# EAGLE design MAX3221EEAE-Breakout (EAGLE 7.6.0)
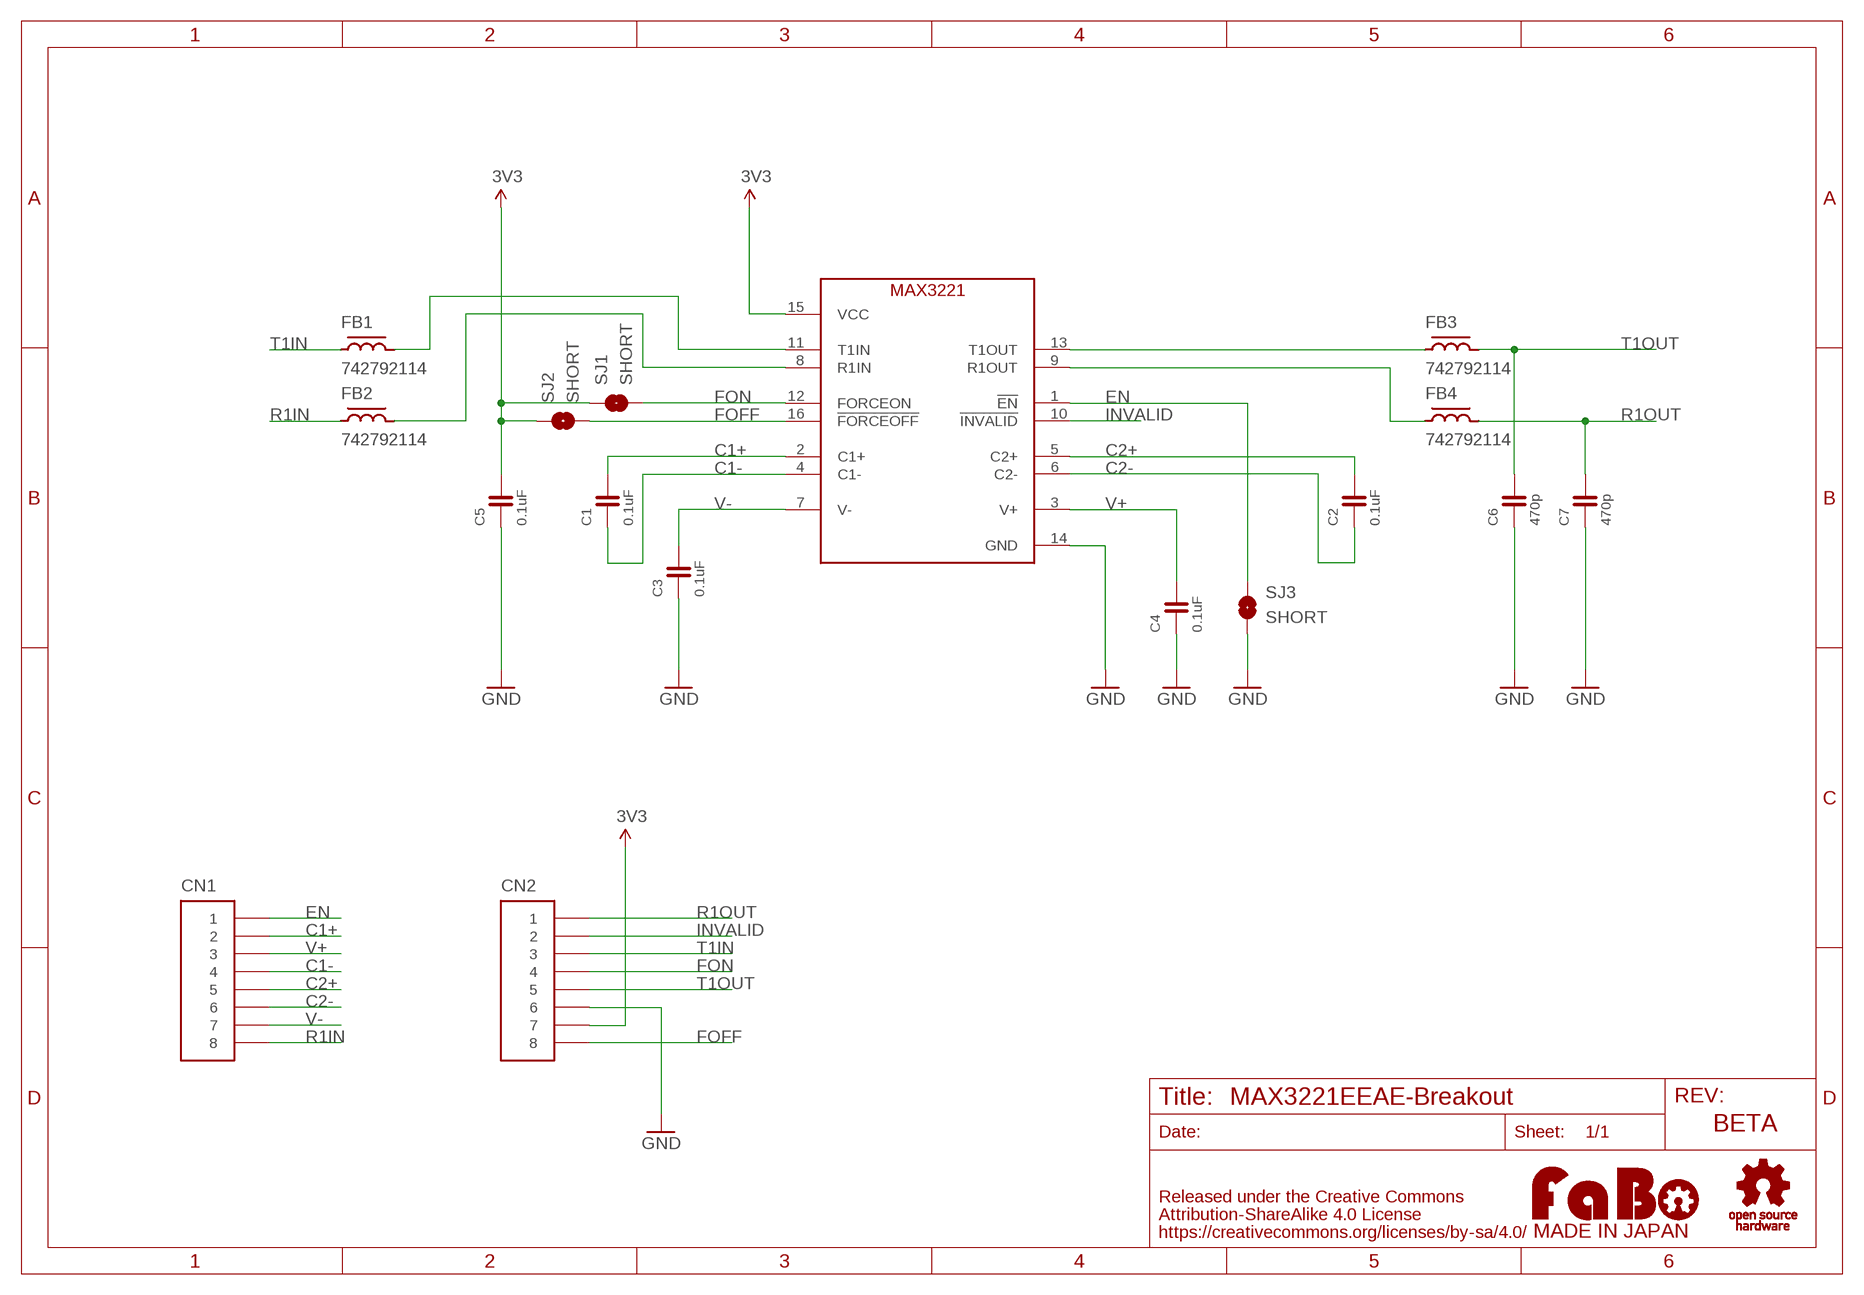
[diagram p0: schematic, sheet 1]

## Parts
C1  0.1uF  CAPACITOR-0603  [0603]
C2  0.1uF  CAPACITOR-0603  [0603]
C3  0.1uF  CAPACITOR-0603  [0603]
C4  0.1uF  CAPACITOR-0603  [0603]
C5  0.1uF  CAPACITOR-0603  [0603]
C6  470p  CAPACITOR-0603  [0603]
C7  470p  CAPACITOR-0603  [0603]
CN1  PIN_HEADER_1X8  [PIN_1X8]
CN2  PIN_HEADER_1X8  [PIN_1X8]
FB1  742792114  FERRITEBEADS-1206  [EIA1206]
FB2  742792114  FERRITEBEADS-1206  [EIA1206]
FB3  742792114  FERRITEBEADS-1206  [EIA1206]
FB4  742792114  FERRITEBEADS-1206  [EIA1206]
IC1  MAX3221EEAE  [SSOP-16]
SJ1  SHORT  SMD-JUMPER-2-SHORT  [SMD-JUMPER-2-SHORT]
SJ2  SHORT  SMD-JUMPER-2-SHORT  [SMD-JUMPER-2-SHORT]
SJ3  SHORT  SMD-JUMPER-2-SHORT  [SMD-JUMPER-2-SHORT]
U$2  LOGO_FABO-M_BOTTOM  [LOGO_FABO_MS_BOTTOM]
U$3  LOGO_OSHW-M_BOTTOM  [LOGO_OSHW_M_BOTTOM]

## Nets
3V3: C5.2 CN2.7 IC1.15(VCC) SJ1.1 SJ2.1
C1+: C1.2 CN1.2 IC1.2(C1+)
C1-: C1.1 CN1.4 IC1.4(C1-)
C2+: C2.2 CN1.5 IC1.5(C2+)
C2-: C2.1 CN1.6 IC1.6(C2-)
EN: CN1.1 IC1.1(!EN) SJ3.1
FOFF: CN2.8 IC1.16(!FORCEOFF) SJ2.2
FON: CN2.4 IC1.12(FORCEON) SJ1.2
GND: C3.1 C4.1 C5.1 C6.1 C7.1 CN2.6 IC1.14(GND) SJ3.2
INVALID: CN2.2 IC1.10(!INVALID)
R1IN: CN1.8 FB2.1
R1IN_R: FB2.2 IC1.8(R1IN)
R1OUT: C7.2 CN2.1 FB4.2
R1OUT_R: FB4.1 IC1.9(R1OUT)
T1IN: CN2.3 FB1.1
T1IN_R: FB1.2 IC1.11(T1IN)
T1OUT: C6.2 CN2.5 FB3.2
T1OUT_R: FB3.1 IC1.13(T1OUT)
V+: C4.2 CN1.3 IC1.3(V+)
V-: C3.2 CN1.7 IC1.7(V-)

## Notes on the sheet
- BETA

## Library data of the parts
C1-C7 = FaBo-Capacitor:CAPACITOR: CAPACITOR
CN1 CN2 = FaBo-PIN:PIN_HEADER_1X8
FB1-FB4 = FaBo-Parts:FERRITEBEADS
IC1 = FaBo-LevelTranslator:MAX3221EEAE
SJ1-SJ3 = FaBo-Supply:SMD-JUMPER-2
U$2 = FaBo-etc:LOGO_FABO
U$3 = FaBo-etc:LOGO_OSHW

## Board
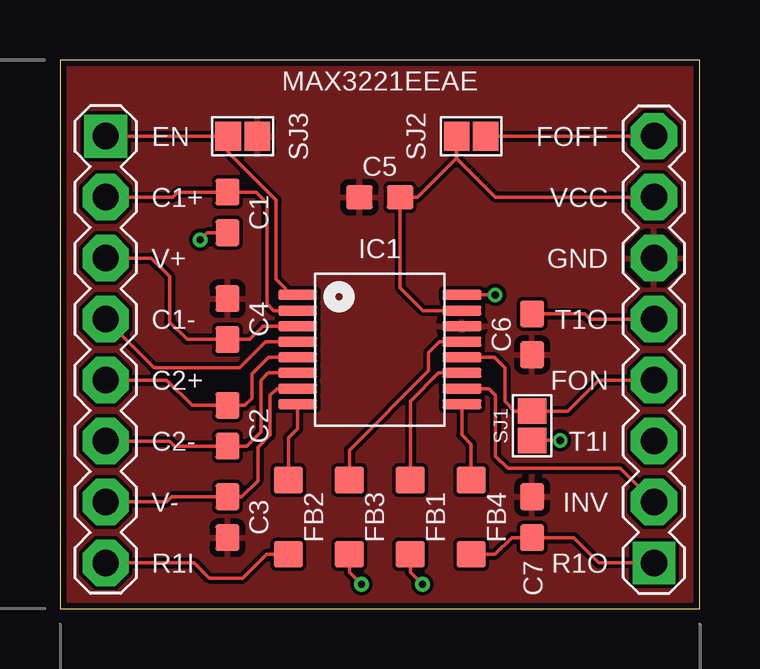
[diagram p1: board, top side]
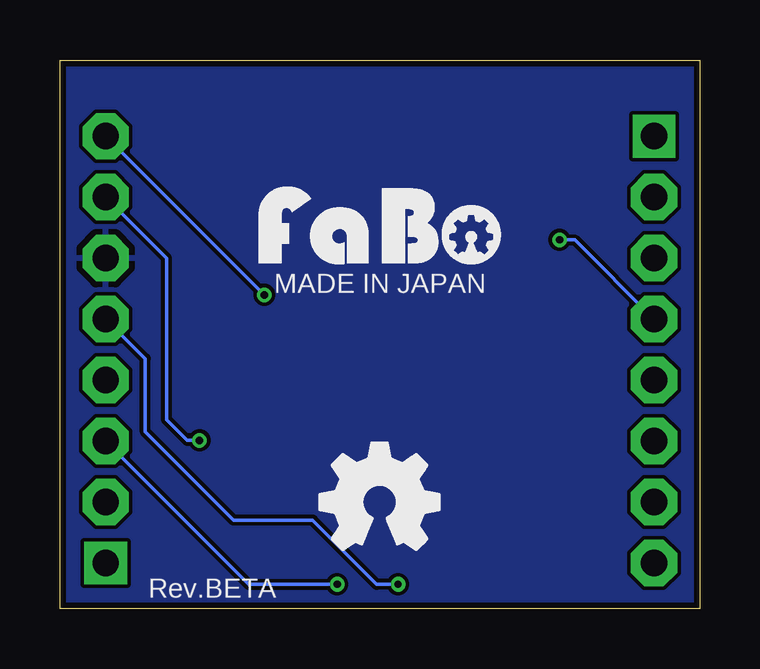
[diagram p2: board, bottom side, seen from below]

Size 26.67 x 22.86 mm. Coordinates in mm from the lower left corner, seen from the top.
Outline: 0,0 26.67,0 26.67,22.86 0,22.86 0,0
Copper layers (1*16): Top 0.035mm / dielectric 1.5mm / Bottom 0.035mm
Design rules "Elecrow_angle": minimum track width 6mil, minimum drill 12mil, track to track 6mil, track to pad 6mil, pad to pad 6mil, via to via 6mil, smd to smd 0mil, copper to edge 10mil, drill to drill 10mil, minimum pad ring 10mil, minimum via ring 6mil, stop-mask expansion 2mil, vias tented up to drill 100mil, thermal gap 10mil

### Footprints (pad centres in the part's own frame; a part is rotated, then mirrored left to right if it is on the bottom)
0603 = smd 1.1 x 1: 1 -0.85,0; 2 0.85,0
PIN_1X8 = drill 1.1 pad 1.778 square: 1 -8.89,0 | drill 1.1 pad 1.93 octagon: 2 -6.35,0; 3 -3.81,0; 4 -1.27,0; 5 1.27,0; 6 3.81,0; 7 6.35,0; 8 8.89,0
EIA1206 = smd 1.1 x 1.2: 1 -1.55,0; 2 1.55,0
SSOP-16 = smd 1.63 x 0.42: 1 -3.425,2.275; 2 -3.425,1.625; 3 -3.425,0.975; 4 -3.425,0.325; 5 -3.425,-0.325; 6 -3.425,-0.975; 7 -3.425,-1.625; 8 -3.425,-2.275; 9 3.425,-2.275; 10 3.425,-1.625; 11 3.425,-0.975; 12 3.425,-0.325; 13 3.425,0.325; 14 3.425,0.975; 15 3.425,1.625; 16 3.425,2.275
SMD-JUMPER-2-SHORT = smd 1.067 x 1.2: 1 -0.61,0; 2 0.61,0

### Placement (x,y rotation side)
C1  6.99,16.51 90 top
C2  6.99,7.62 90 top
C3  6.99,3.81 90 top
C4  6.99,12.06 270 top
C5  13.34,17.14 0 top
C6  19.68,11.43 90 top
C7  19.68,3.81 270 top
CN1  1.91,10.79 270 top
CN2  24.77,10.79 90 top
FB1  14.61,3.81 90 top
FB2  9.53,3.81 90 top
FB3  12.06,3.81 270 top
FB4  17.14,3.81 270 top
IC1  13.34,10.79 0 top
SJ1  19.68,7.62 90 top
SJ2  17.14,19.68 0 top
SJ3  7.62,19.68 0 top
U$2  13.34,13.97 0 top
U$3  13.34,4.45 0 top

### Tracks (layer width: path | path; a pad name or v marks a point on that pad's centre or on a via)
3V3  (via drill 0.3)
  Top 0.152: CN2.7 18.16,17.14 16.54,18.77 | SJ2.1 16.54,18.77 | 16.54,18.77 14.91,17.14 C5.2 14.19,13.37 15.14,12.42 IC1.15 | SJ1.1 v20.85,7.01
  Bottom 0.152: CN2.7 22.23,14.61 22.23,7.87 21.36,7.01 v20.85,7.01
C1+
  Top 0.152: CN1.2 4.7,17.14 4.91,17.36 C1.2 8.17,17.36 8.64,16.89 8.64,12.7 8.92,12.42 IC1.2
C1-  (via drill 0.3)
  Top 0.152: IC1.4 8.58,11.12 7.49,10.03 3.94,10.03 CN1.4 | C1.1 6.13,15.66 v5.84,15.37
  Bottom 0.152: v5.84,15.37 5.21,15.37 CN1.4
C2+
  Top 0.152: IC1.5 8.69,10.47 8,9.78 8,8.76 7.71,8.47 C2.2 5.5,8.47 4.45,9.53 CN1.5
C2-
  Top 0.152: IC1.6 8.68,9.82 8.38,9.53 8.38,7.37 7.79,6.77 C2.1 4.79,6.77 4.57,6.99 CN1.6
EN
  Top 0.152: CN1.1 SJ3.1 7.01,19.02 9.02,17.02 9.02,13.72 9.4,13.34 9.4,13.21 9.54,13.07 IC1.1
FOFF  (via drill 0.3)
  Top 0.152: SJ2.2 CN2.8 | IC1.16 v18.15,13.07
  Bottom 0.152: v18.15,13.07 CN2.8
FON
  Top 0.152: CN2.4 22.48,9.53 21.18,8.23 SJ1.2 18.95,8.23 18.54,8.64 18.54,10.03 18.11,10.47 IC1.12
GND
  pour Top: 0,22.86 26.67,22.86 26.67,0 0,0
  pour Bottom: 0,22.86 26.67,22.86 26.67,0 0,0
INVALID
  Top 0.152: IC1.10 17.88,9.17 18.16,8.89 18.16,6.35 18.67,5.84 23.37,5.84 CN2.2
R1IN
  Top 0.152: CN1.8 5.59,1.91 6.22,1.27 7.62,1.27 8.61,2.26 FB2.1
R1IN_R
  Top 0.152: IC1.8 9.91,7.5 9.53,7.11 FB2.2
R1OUT
  Top 0.152: CN2.1 22.48,1.91 21.42,2.96 C7.2 18.84,2.96 18.14,2.26 FB4.2
R1OUT_R
  Top 0.152: IC1.9 16.76,7.24 17.14,6.86 FB4.1
T1IN  (via drill 0.3)
  Top 0.152: v15.11,1.02 14.61,1.52 FB1.1
  Bottom 0.152: CN2.3 18.8,1.02 v15.11,1.02
T1IN_R
  Top 0.152: IC1.11 15.79,9.82 14.61,8.64 FB1.2
T1OUT  (via drill 0.3)
  Top 0.152: CN2.5 22.1,12.06 21.88,12.28 C6.2 | FB3.2 12.06,1.52 v12.57,1.02
  Bottom 0.152: v12.57,1.02 13.46,1.02 16.13,3.68 19.43,3.68 23.11,7.37 23.11,10.41 CN2.5
T1OUT_R
  Top 0.152: IC1.13 15.82,11.12 15.37,10.67 15.37,9.91 12.06,6.6 FB3.1
V+
  Top 0.152: IC1.3 8.47,11.77 7.91,11.21 C4.2 5.29,11.21 4.57,11.94 4.57,13.84 3.81,14.61 CN1.3
V-
  Top 0.152: IC1.7 9.04,9.17 8.76,8.89 8.76,7.24 8.26,6.73 8.26,5.33 7.58,4.66 C3.2 4.66,4.66 4.45,4.45 CN1.7

### Text on the board
tPlace: MAX3221EEAE | EN | FOFF | C1+ | VCC | V+ | GND | C1- | T1O | C2+ | FON | C2- | T1I | V- | INV | R1I | R1O
bPlace: MADE IN JAPAN | Rev.BETA